# EAGLE design RoverWing-V1.4 (EAGLE 9.2.2)
Assembly variants: LCSC, DIGIKEY

## Sheet 1 of 2
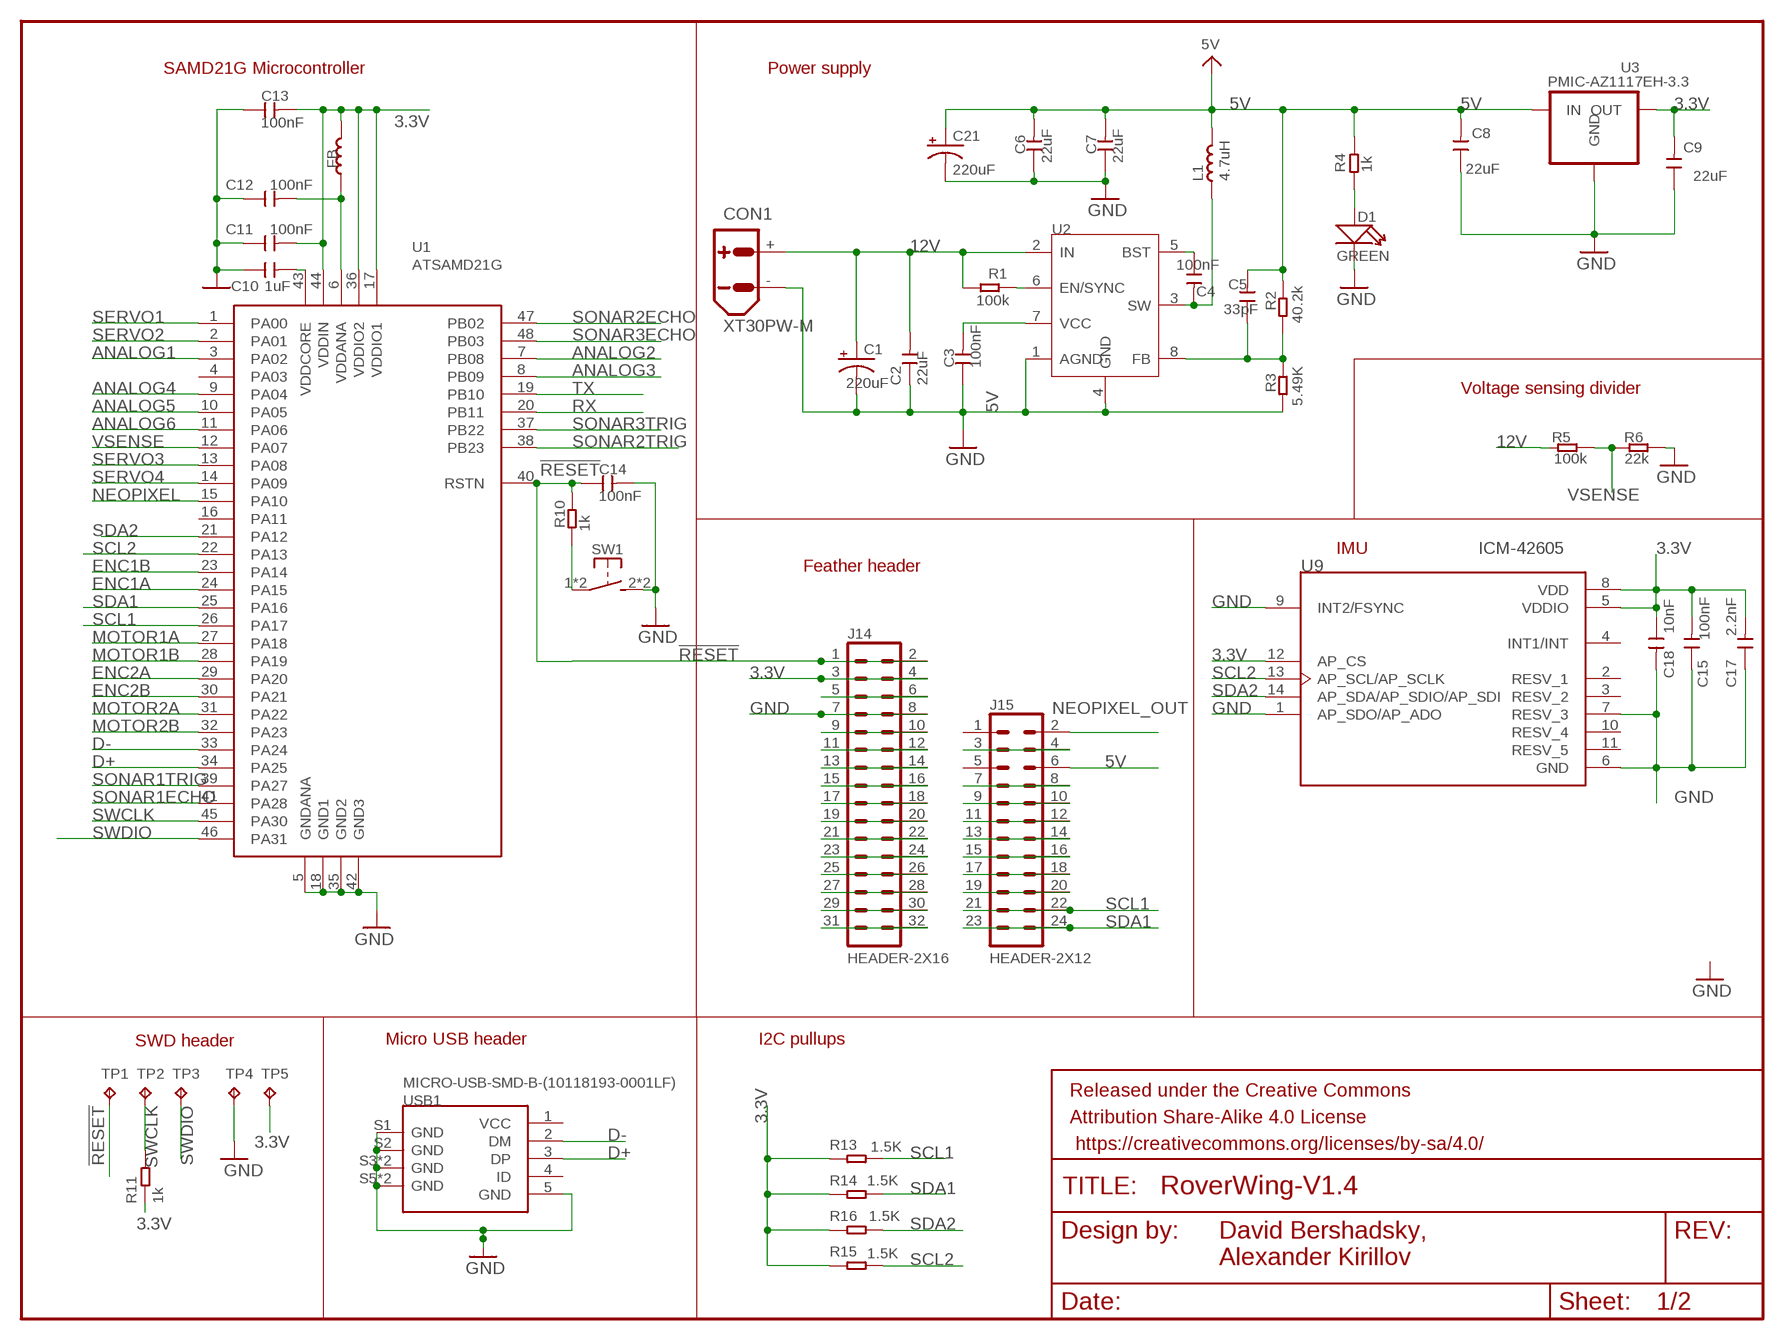
[diagram p0: schematic, sheet 1]

### Parts
C1  220uF  CAP-POL-SMD-8X10.5  [CAP-8X10.5]
C2  22uF  CAP-CERAMIC-SMD0805  [0805]
C3  100nF  CAP-CERAMIC-SMD0805  [0805]
C4  100nF  CAP-CERAMIC-SMD0805  [0805]
C5  33pF  CAP-CERAMIC-SMD0805  [0805]
C6  22uF  CAP-CERAMIC-SMD0805  [0805]
C7  22uF  CAP-CERAMIC-SMD0805  [0805]
C8  22uF  CAP-CERAMIC-SMD0805  [0805]
C9  22uF  CAP-CERAMIC-SMD0805  [0805]
C10  1uF  CAP-CERAMIC-SMD0805  [0805]
C11  100nF  CAP-CERAMIC-SMD0805  [0805]
C12  100nF  CAP-CERAMIC-SMD0805  [0805]
C13  100nF  CAP-CERAMIC-SMD0805  [0805]
C14  100nF  CAP-CERAMIC-SMD0805  [0805]
C15  100nF  CAP-CERAMIC-SMD0805  [0805]
C17  2.2nF  CAP-CERAMIC-SMD0805  [0805]
C18  10nF  CAP-CERAMIC-SMD0805  [0805]
C21  220uF  CAP-POL-SMD-6.3X5.4  [CAP-6.3X5.4]
CON1  XT30PW-M  [XT30PW-M]
D1  GREEN  SMD-LED-0805  [LED-0805]
FB  330R-1500MA  SMD-FERRITE-BEAD-330R-1500MA(0805)  [0805]
FRAME2  FRAME-LETTERNO_PACKAGE  [DUMMY]
J14  HEADER-2X16  [2X16]
J15  HEADER-2X12  [2X12]
L1  4.7uH  IND-TDK-SPM6530T  [IND_TDK_7.1X6.5]
R1  100k  RES-SMD-0805  [0805]
R2  40.2k  RES-SMD-0805  [0805]
R3  5.49K  RES-SMD-0805  [0805]
R4  1k  RES-SMD-0805  [0805]
R5  100k  RES-SMD-0805  [0805]
R6  22k  RES-SMD-0805  [0805]
R10  1k  RES-SMD-0805  [0805]
R11  1k  RES-SMD-0805  [0805]
R13  1.5K  SMD-RES-1.8K-1%-1/10W(0603)  [R0603]
R14  1.5K  SMD-RES-1.8K-1%-1/10W(0603)  [R0603]
R15  1.5K  SMD-RES-1.8K-1%-1/10W(0603)  [R0603]
R16  1.5K  SMD-RES-1.8K-1%-1/10W(0603)  [R0603]
SW1  SW-TACTILE-4.5X4.5_SMD  [TL3305]
TP1  TPTP15R  [TP15R]
TP2  TPTP15R  [TP15R]
TP3  TPTP15R  [TP15R]
TP4  TPTP15R  [TP15R]
TP5  TPTP15R  [TP15R]
U1  ATSAMD21G  [TQFP-48-EDITED]
U2  MP2225  PMIC-MP2225  [SOT-23-8]
U3  PMIC-AZ1117EH-3.3  [SOT223]
U9  ICM-42605  [PQFN50P300X250X97-14N]
USB1  MICRO-USB-SMD-B-(10118193-0001LF)  [MICRO-USB5+6P-SMD-0.65-B]

### Nets
3.3V: C9.2 C11.2 C13.2 C15.2 C17.2 C18.1 FB.2 J14.3 J14.4 R11.1 R13.1 R14.1 R15.1 R16.1 TP5.TP U1.17(VDDIO1) U1.36(VDDIO2) U1.44(VDDIN) U3.2(OUT) U3.4(OUT) U9.5(VDDIO) U9.8(VDD) U9.12(AP_CS) ; also sheet 2
5V: C5.2 C6.2 C7.2 C8.2 C21.+ J15.6 L1.2 R2.1 R4.2 U3.3(IN) ; also sheet 2
12V: C1.+ C2.2 CON1.+ R1.2 R5.2 U2.2(IN) ; also sheet 2
!RESET: C14.1 J14.1 J14.2 R10.2 TP1.TP U1.40(RSTN)
ANALOG1: U1.3(PA02) ; also sheet 2
ANALOG2: U1.7(PB08) ; also sheet 2
ANALOG3: U1.8(PB09) ; also sheet 2
ANALOG4: U1.9(PA04) ; also sheet 2
ANALOG5: U1.10(PA05) ; also sheet 2
ANALOG6: U1.11(PA06) ; also sheet 2
BST: C4.1 U2.5(BST)
D+: U1.34(PA25) USB1.3(DP)
D-: U1.33(PA24) USB1.2(DM)
ENC1A: U1.24(PA15) ; also sheet 2
ENC1B: U1.23(PA14) ; also sheet 2
ENC2A: U1.29(PA20) ; also sheet 2
ENC2B: U1.30(PA21) ; also sheet 2
FB: C5.1 R2.2 R3.1 U2.8(FB)
GND: C1.- C2.1 C3.1 C6.1 C7.1 C8.1 C9.1 C10.1 C11.1 C12.1 C13.1 C14.2 C15.1 C17.1 C18.2 C21.- CON1.- D1.- J14.7 J14.8 R3.2 R6.2 SW1.2(S1) SW1.3(S1) TP4.TP U1.5(GNDANA) U1.18(GND1) U1.35(GND2) U1.42(GND3) U2.1(AGND) U2.4(GND) U3.1(GND) U9.1(AP_SDO/AP_ADO) U9.6(GND) U9.7(RESV_3) U9.9(INT2/FSYNC) USB1.5(GND) USB1.S1(GND) USB1.S2(GND) USB1.S3(GND) USB1.S4(GND) USB1.S5(GND) USB1.S6(GND) ; also sheet 2
MOTOR1A: U1.27(PA18) ; also sheet 2
MOTOR1B: U1.28(PA19) ; also sheet 2
MOTOR2A: U1.31(PA22) ; also sheet 2
MOTOR2B: U1.32(PA23) ; also sheet 2
N$5: J15.3 J15.4
N$9: J15.7 J15.8
N$11: R10.1 SW1.1 SW1.4(P1)
N$12: J15.9 J15.10
N$14: C10.2 U1.43(VDDCORE)
N$15: J15.11 J15.12
N$17: D1.+ R4.1
N$18: J15.15 J15.16
N$22: J15.13 J15.14
N$23: R1.1 U2.6(EN/SYNC)
N$29: C3.2 U2.7(VCC)
N$42: J14.5 J14.6
N$45: J15.17 J15.18
N$46: J15.19 J15.20
N$48: J14.9 J14.10
N$49: J14.11 J14.12
N$50: J14.13 J14.14
N$51: J14.15 J14.16
N$52: J14.17 J14.18
N$53: J14.19 J14.20
N$54: J14.21 J14.22
N$55: J14.23 J14.24
N$56: J14.25 J14.26
N$57: J14.27 J14.28
N$58: J14.29 J14.30
N$59: J14.31 J14.32
NEOPIXEL: U1.15(PA10) ; also sheet 2
NEOPIXEL_OUT: J15.2 ; also sheet 2
RX: U1.20(PB11) ; also sheet 2
SCL1: J15.21 J15.22 R13.2 U1.26(PA17) ; also sheet 2
SCL2: R15.2 U1.22(PA13) U9.13(AP_SCL/AP_SCLK) ; also sheet 2
SDA1: J15.23 J15.24 R14.2 U1.25(PA16) ; also sheet 2
SDA2: R16.2 U1.21(PA12) U9.14(AP_SDA/AP_SDIO/AP_SDI) ; also sheet 2
SERVO1: U1.1(PA00) ; also sheet 2
SERVO2: U1.2(PA01) ; also sheet 2
SERVO3: U1.13(PA08) ; also sheet 2
SERVO4: U1.14(PA09) ; also sheet 2
SONAR1ECHO: U1.41(PA28) ; also sheet 2
SONAR1TRIG: U1.39(PA27) ; also sheet 2
SONAR2ECHO: U1.47(PB02) ; also sheet 2
SONAR2TRIG: U1.38(PB23) ; also sheet 2
SONAR3ECHO: U1.48(PB03) ; also sheet 2
SONAR3TRIG: U1.37(PB22) ; also sheet 2
SW: C4.2 L1.1 U2.3(SW)
SWCLK: R11.2 TP2.TP U1.45(PA30)
SWDIO: TP3.TP U1.46(PA31)
TX: U1.19(PB10) ; also sheet 2
VDDANA: C12.2 FB.1 U1.6(VDDANA)
VSENSE: R5.1 R6.1 U1.12(PA07)
Unconnected: J15.1 J15.5 U1.4(PA03) U1.16(PA11) U9.2(RESV_1) U9.3(RESV_2) U9.4(INT1/INT) U9.10(RESV_4) U9.11(RESV_5) USB1.1(VCC) USB1.4(ID)

### Notes on the sheet
- SAMD21G Microcontroller | Power supply
- Voltage sensing divider
- IMU
- Feather header
- SWD header
- Micro USB header | I2C pullups
- David Bershadsky, 
  Alexander Kirillov

## Sheet 2 of 2
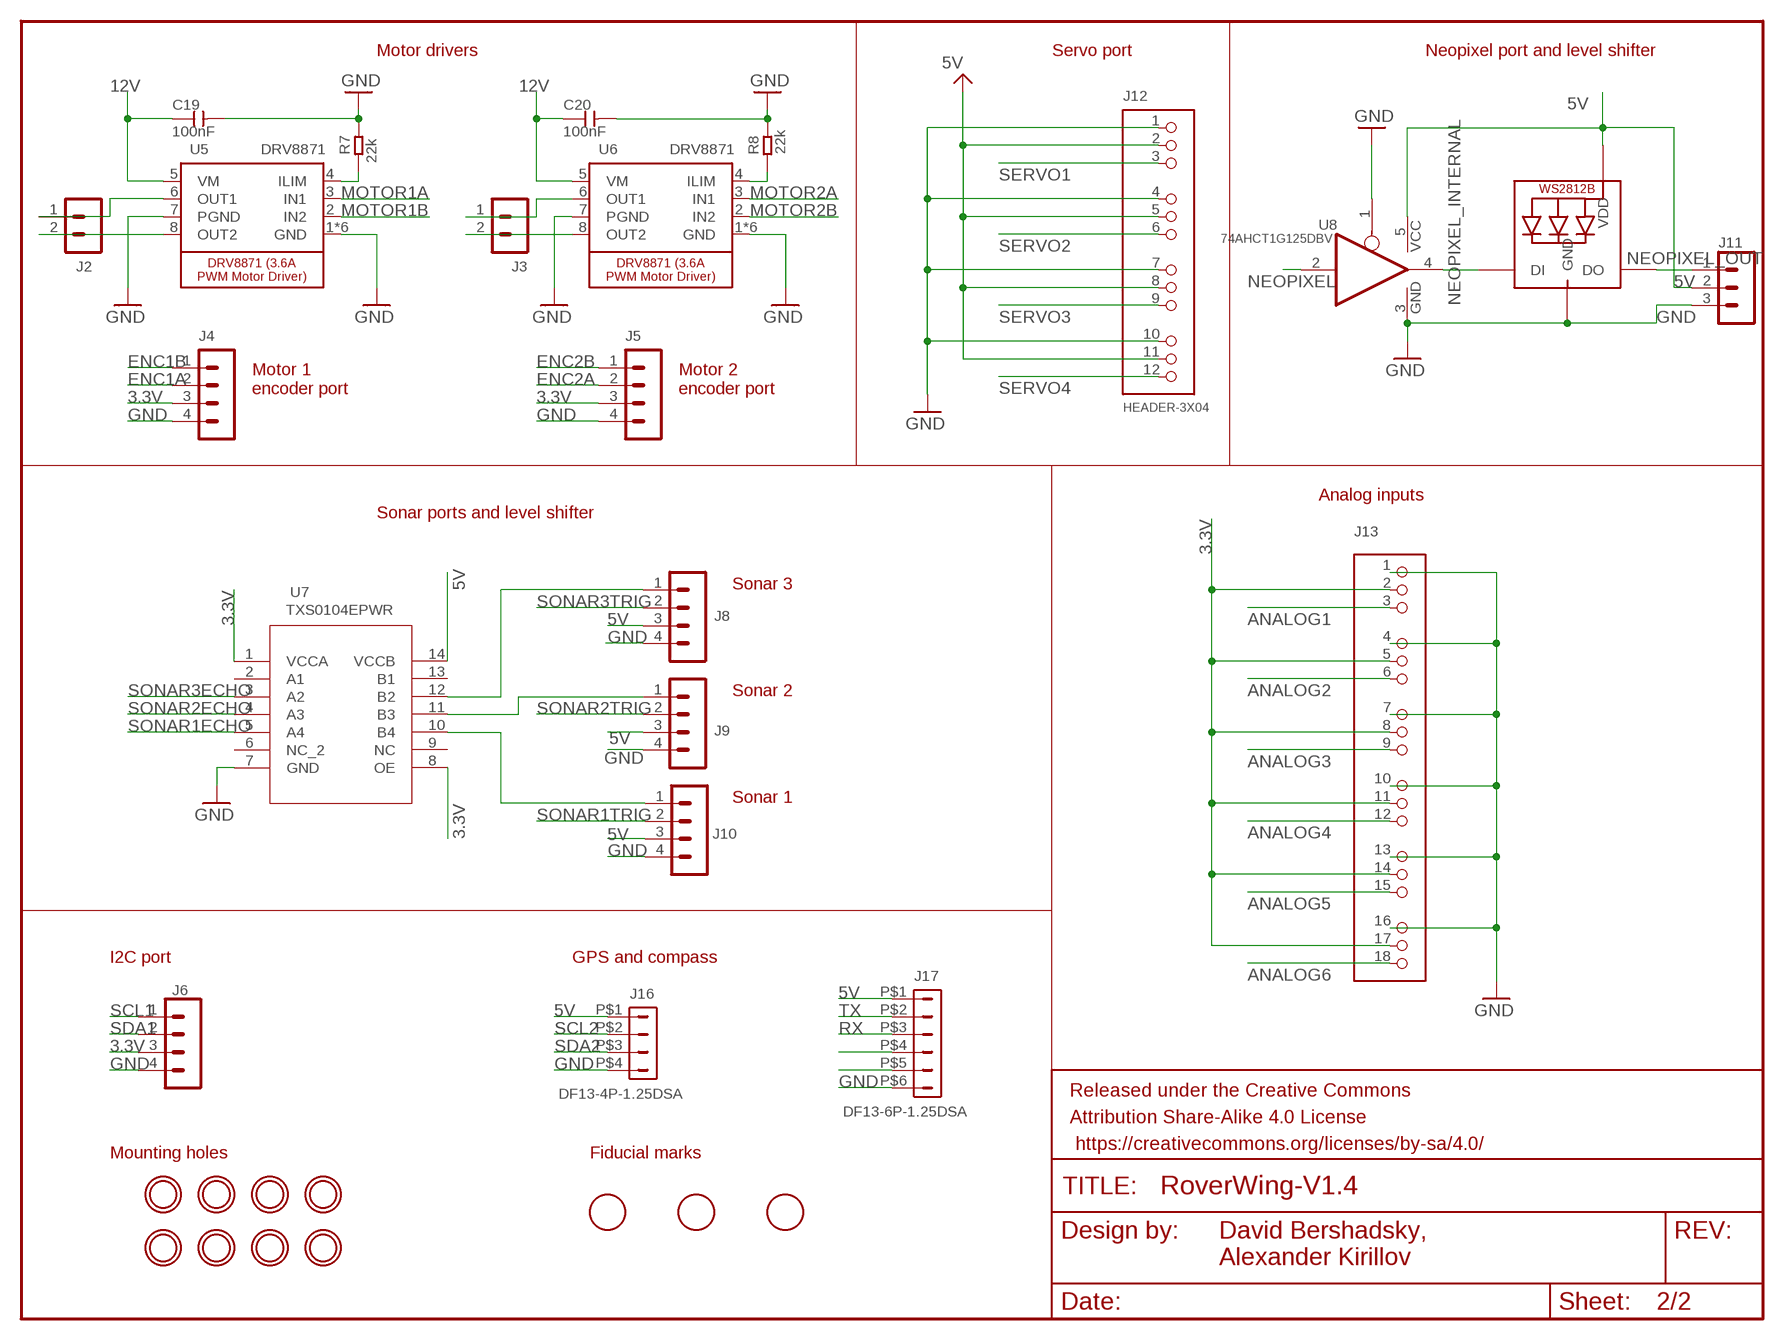
[diagram p1: schematic, sheet 2]

### Parts
C19  100nF  CAP-CERAMIC-SMD0805  [0805]
C20  100nF  CAP-CERAMIC-SMD0805  [0805]
D2  WS2812B3535  [LED3535]
FRAME1  FRAME-LETTERNO_PACKAGE  [DUMMY]
J2  HEADER-VH  [B2P-VH]
J3  HEADER-VH  [B2P-VH]
J4  HEADER-PH-4P  [B4B-PH-K]
J5  HEADER-PH-4P  [B4B-PH-K]
J6  HEADER-PH-4P  [B4B-PH-K]
J8  HEADER-PH-4P  [B4B-PH-K]
J9  HEADER-PH-4P  [B4B-PH-K]
J10  HEADER-PH-4P  [B4B-PH-K]
J11  HEADER-PH-3P  [B3B-PH-K]
J12  HEADER-3X04  [3X04]
J13  HEADER-3X06"  [3X06]
J16  DF13-4P-1.25DSA  [DF13-4P-1.25DSA]
J17  DF13-6P-1.25DSA  [DF13-6P-1.25DSA]
R7  22k  RES-SMD-0805  [0805]
R8  22k  RES-SMD-0805  [0805]
U5  DRV8871  [HSOP8]
U6  DRV8871  [HSOP8]
U7  TXS0104EPWR  [PW14]
U8  74AHCT1G125DBV  [SOT23-5]
U$3  MOUNTINGHOLE3.0_NPH  [MOUNTINGHOLE_3.0_NPH]
U$4  MOUNTINGHOLE3.0_NPH  [MOUNTINGHOLE_3.0_NPH]
U$11  FIDUCIAL  [FIDUCIAL_1MM]
U$13  FIDUCIAL  [FIDUCIAL_1MM]
U$14  MOUNTINGHOLE3.0_NPH  [MOUNTINGHOLE_3.0_NPH]
U$15  MOUNTINGHOLE3.0_NPH  [MOUNTINGHOLE_3.0_NPH]
U$17  FIDUCIAL  [FIDUCIAL_1MM]
U$24  MOUNTINGHOLE3.0_NPH  [MOUNTINGHOLE_3.0_NPH]
U$25  MOUNTINGHOLE3.0_NPH  [MOUNTINGHOLE_3.0_NPH]
U$26  MOUNTINGHOLE3.0_NPH  [MOUNTINGHOLE_3.0_NPH]
U$27  MOUNTINGHOLE3.0_NPH  [MOUNTINGHOLE_3.0_NPH]

### Nets
3.3V: J4.3 J5.3 J6.3 J13.2 J13.5 J13.8 J13.11 J13.14 J13.17 U7.1(VCCA) U7.8(OE) ; also sheet 1
5V: D2.3(VDD) J8.3 J9.3 J10.3 J11.2 J12.2 J12.5 J12.8 J12.11 J16.P$1 J17.P$1 U7.14(VCCB) U8.5(VCC) ; also sheet 1
12V: C19.1 C20.1 U5.5(VM) U6.5(VM) ; also sheet 1
ANALOG1: J13.3 ; also sheet 1
ANALOG2: J13.6 ; also sheet 1
ANALOG3: J13.9 ; also sheet 1
ANALOG4: J13.12 ; also sheet 1
ANALOG5: J13.15 ; also sheet 1
ANALOG6: J13.18 ; also sheet 1
ENC1A: J4.2 ; also sheet 1
ENC1B: J4.1 ; also sheet 1
ENC2A: J5.2 ; also sheet 1
ENC2B: J5.1 ; also sheet 1
GND: C19.2 C20.2 D2.1(GND) J4.4 J5.4 J6.4 J8.4 J9.4 J10.4 J11.3 J12.1 J12.4 J12.7 J12.10 J13.1 J13.4 J13.7 J13.10 J13.13 J13.16 J16.P$4 J17.P$6 R7.2 R8.2 U5.1(GND) U5.7(PGND) U5.GND U5.P$1(GND) U5.P$2(GND) U5.P$3(GND) U5.P$4(GND) U6.1(GND) U6.7(PGND) U6.GND U6.P$1(GND) U6.P$2(GND) U6.P$3(GND) U6.P$4(GND) U7.7(GND) U8.1(OE) U8.3(GND) ; also sheet 1
MOTOR1A: U5.3(IN1) ; also sheet 1
MOTOR1B: U5.2(IN2) ; also sheet 1
MOTOR2A: U6.3(IN1) ; also sheet 1
MOTOR2B: U6.2(IN2) ; also sheet 1
N$1: J3.2 U6.8(OUT2)
N$2: J3.1 U6.6(OUT1)
N$4: J2.2 U5.8(OUT2)
N$7: J10.1 U7.10(B4)
N$10: J8.1 U7.12(B2)
N$16: J2.1 U5.6(OUT1)
N$19: R7.1 U5.4(ILIM)
N$20: R8.1 U6.4(ILIM)
N$21: J9.1 U7.11(B3)
N$26: J17.P$4
N$27: J17.P$5
NEOPIXEL: U8.2(I) ; also sheet 1
NEOPIXEL_INTERNAL: D2.2(DI) U8.4(O)
NEOPIXEL_OUT: D2.4(DO) J11.1 ; also sheet 1
RX: J17.P$3 ; also sheet 1
SCL1: J6.1 ; also sheet 1
SCL2: J16.P$2 ; also sheet 1
SDA1: J6.2 ; also sheet 1
SDA2: J16.P$3 ; also sheet 1
SERVO1: J12.3 ; also sheet 1
SERVO2: J12.6 ; also sheet 1
SERVO3: J12.9 ; also sheet 1
SERVO4: J12.12 ; also sheet 1
SONAR1ECHO: U7.5(A4) ; also sheet 1
SONAR1TRIG: J10.2 ; also sheet 1
SONAR2ECHO: U7.4(A3) ; also sheet 1
SONAR2TRIG: J9.2 ; also sheet 1
SONAR3ECHO: U7.3(A2) ; also sheet 1
SONAR3TRIG: J8.2 ; also sheet 1
TX: J17.P$2 ; also sheet 1
Unconnected: U7.2(A1) U7.6(NC_2) U7.9(NC) U7.13(B1)

### Notes on the sheet
- Motor drivers | Servo port | Neopixel port and level shifter
- Motor 1
  encoder port
- Motor 2 
  encoder port
- Analog inputs
- Sonar ports and level shifter
- Sonar 3
- Sonar 2
- Sonar 1
- I2C port | GPS and compass
- Mounting holes | Fiducial marks
- David Bershadsky, 
  Alexander Kirillov

## Library data of the parts
C1 = RoverWing:CAP-POL-SMD-8X10.5: AL CAPACITOR, SMD 8x10.5 mm
C2-C15 C17-C20 = RoverWing:CAP-CERAMIC-SMD: CAP CERAMIC, SMD
C21 = RoverWing:CAP-POL-SMD-6.3X5.4: AL CAP, SMD, 47uF; PARTNO: CS1E470M-CRE54
CON1 = amass:XT30: AMASS XT30 connector Store in Japan AMASS XT30 connector <https://szc.jp/ams-xt30>
D1 = RoverWing:SMD-LED-0805: SMD LED, 0805
D2 = RoverWing:WS2812B; MANUFACTURER: Worldsemi; PARTNO: WS2812B-3535
FB = RoverWing:SMD-FERRITE-BEAD-330R-1500MA(0805): Ferrite Bead 330R, 1500 MA; PARTNO: BLM21PG331SN1D; SIZE: 0805
FRAME1 FRAME2 = RoverWing:FRAME-LETTER: Schematic Frame - Letter Standard 8.5x11 US Letter frame; BOM: EXCLUDE
J2 J3 = RoverWing:HEADER-VH: HEADER - JST VH, 2P 3.96mm pitch; PARTNO: B2P-VH(LF)(SN)
J4-J6 J8-J10 = RoverWing:HEADER-PH-4P: HEADER; PARTNO: B4B-PH-K-S(LF)(SN)
J11 = RoverWing:HEADER-PH-3P: HEADER; PARTNO: B3B-PH-K-S(LF)(SN)
J12 = RoverWing:HEADER-3X04
J13 = RoverWing:HEADER-3X06
J14 = RoverWing:HEADER-2X16: HEADER - 2x16, 0.1" PITCH
J15 = RoverWing:HEADER-2X12: Multi connection point. Often used as Generic Header-pin footprint for 0.1 inch spaced/style header connections On any of the 0.1 inch spaced packages, you can populate with these: Break Away Headers - Straight <https://www.sparkfun.com/products/116> (PRT-00116) Break Away Male Headers - Right Angle <https://www.sparkfun.com/products/553> (PRT-00553) Female Headers <https://www.sparkfun.com/products/115> (PRT-00115) Break Away Headers - Machine Pin <https://www.sparkfun.com/products/117> (PRT-00117) Break Away Female Headers - Swiss Machine Pin <https://www.sparkfun.com/products/743> (PRT-00743)
J16 = RoverWing:DF13-4P-1.25: DF13-4P 1.25mm Pitch Miniature Crimping Connector.; PARTNO: DF13-4P-1.25DSA
J17 = RoverWing:DF13-6P-1.25: DF13-6P 1.25mm Pitch Miniature Crimping Connector.; PARTNO: DF13-6P-1.25DSA
L1 = RoverWing:IND-TDK-SPM6530T: Power inductor, SMD, 4.7uH, 5.2A Manufacturer: TDK; MANUFACTURER: TDK; PARTNO: SPM6530T-4R7M
R1-R8 R10 R11 = RoverWing:RES-SMD-0805
R13-R16 = Seeed-Resistor:SMD-RES-1.8K-1%-1/10W(0603): 301010254; MPN: RC0603FR-071K8L; VALUE: 1.8K
SW1 = RoverWing:SW-TACTILE: Tactile Switche; MANUFACTURER: BRIGHT; PARTNO: TSA453G38-250
TP1-TP5 = RoverWing:TP: Test pad; BOM: EXCLUDE
U1 = RoverWing:ATSAMD21G: SAMD21G MCU ARM® Cortex®-M0+ SAM D21G Microcontroller by Microchip Technology Specs: 32 bits 48 Mhz frequency 256 KB flash memory, 32 KB RAM Package: TQFP48 MPN: ATSAMD21G18A-AU; MANUFACTURER: Microchip Technology; PARTNO: ATSAMD21G18A-AU
U2 = RoverWing:PMIC-MP2225: MP2225 buck converter Manufacturer: Monolithic Power Systems Specs: Vin: 4.5-18 V Vout: up to 13.7 V Iout: up to 5A; MANUFACTURER: Monolithic Power Systems; PARTNO: MP2225GJ
U3 = RoverWing:PMIC-AZ1117EH-*; PARTNO: AZ1117EH-3.3TRG1
U5 U6 = RoverWing:DRV8871: DRV8871 - 3.6A PWM Motor Driver; MANUFACTURER: TEXAS INSTRUMENTS; PARTNO: DRV8871DDAR; SIZE: HSOP8
U7 = RoverWing:TXS0104EPWR: Bidirectional Voltage Level Translator, 4 Channel; MANUFACTURER: Texas Instruments; PARTNO: TXS0104EPWR
U8 = RoverWing:74*1G125: Single Bus Buffer Gate with 3-State Output; PARTNO: SN74AHCT1G125DBVR
U9 = ICM-42605:ICM-42605: Single-Interface MotionTracking device The ICM-42605 is a 6-axis MotionTracking device that combines a 3-axis gyroscope, and a 3-axis accelerometer in a small 2.5x3x0.91 mm (14-pin LGA) package. It also features a 2K-byte FIFO that can lower the traffic on the serial bus interface, and reduce power consumption by allowing the system processor to burst read sensor data and then go into a low-power mode.; DESCRIPTION: Accelerometer, Gyroscope, 6 Axis Sensor I²C, I3C℠, SPI Output; DIGI-KEY_PART_NUMBER: 1428-1152-1-ND; DIGI-KEY_PURCHASE_URL: https://www.digikey.com/product-detail/en/tdk-invensense/ICM-42605/1428-1152-1-ND/9953675?utm_source=snapeda&utm_medium=aggregator&utm_campaign=symbol; MF: TDK InvenSense; MP: ICM-42605; PACKAGE: - TDK InvenSense
U$3 U$4 U$14 U$15 U$24-U$27 = RoverWing:MOUNTINGHOLE: Mounting Hole For #2 screws (0.086"/2.18mm width, 0.094"/2.4mm hole) use 2.5mm; BOM: EXCLUDE
U$11 U$13 U$17 = RoverWing:FIDUCIAL: For use by pick and place machines to calibrate the vision/machine, 1mm By microbuilder.eu; BOM: EXCLUDE
USB1 = RoverWing:MICRO-USB-SMD-B-(10118193-0001LF): 320010003; MANUFACTURER: Amphenol ICC; PARTNO: 10118193-0001LF

## Net classes
1 thinpower: width 0.305 mm
2 thickpower: width 0.406 mm

## Board
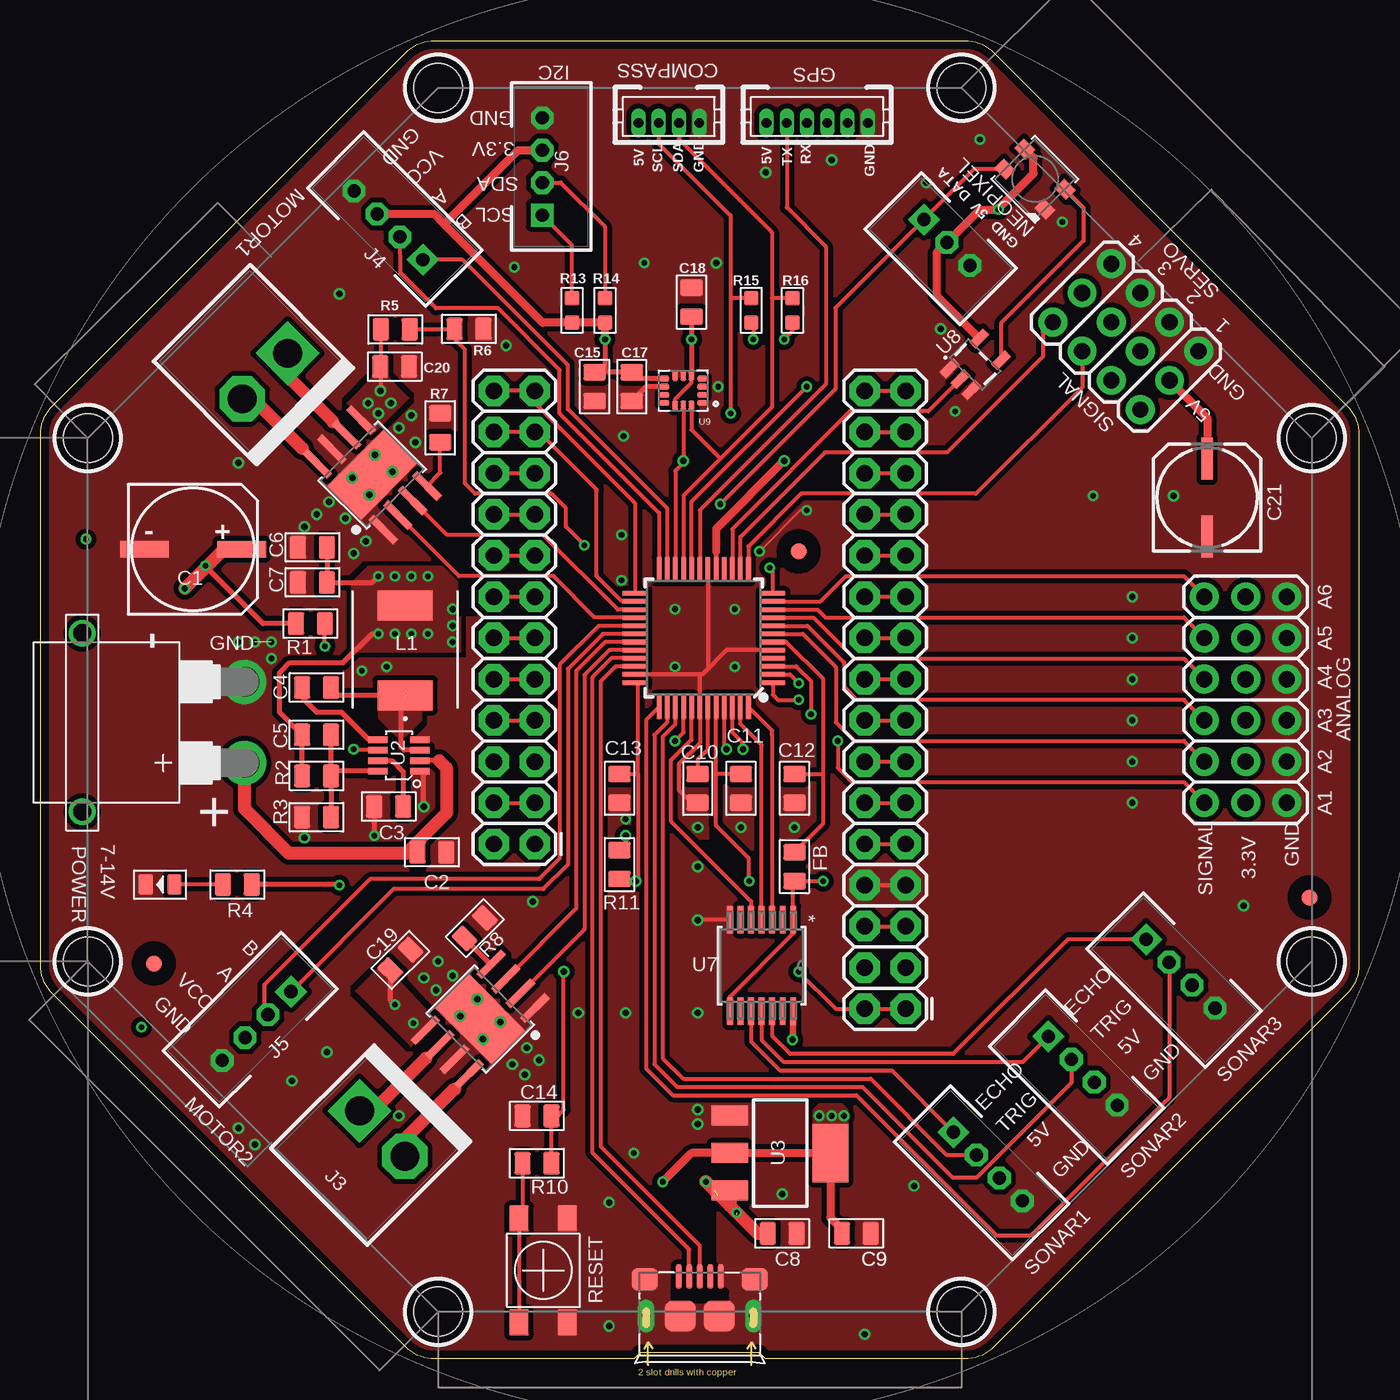
[diagram p2: board, top side]
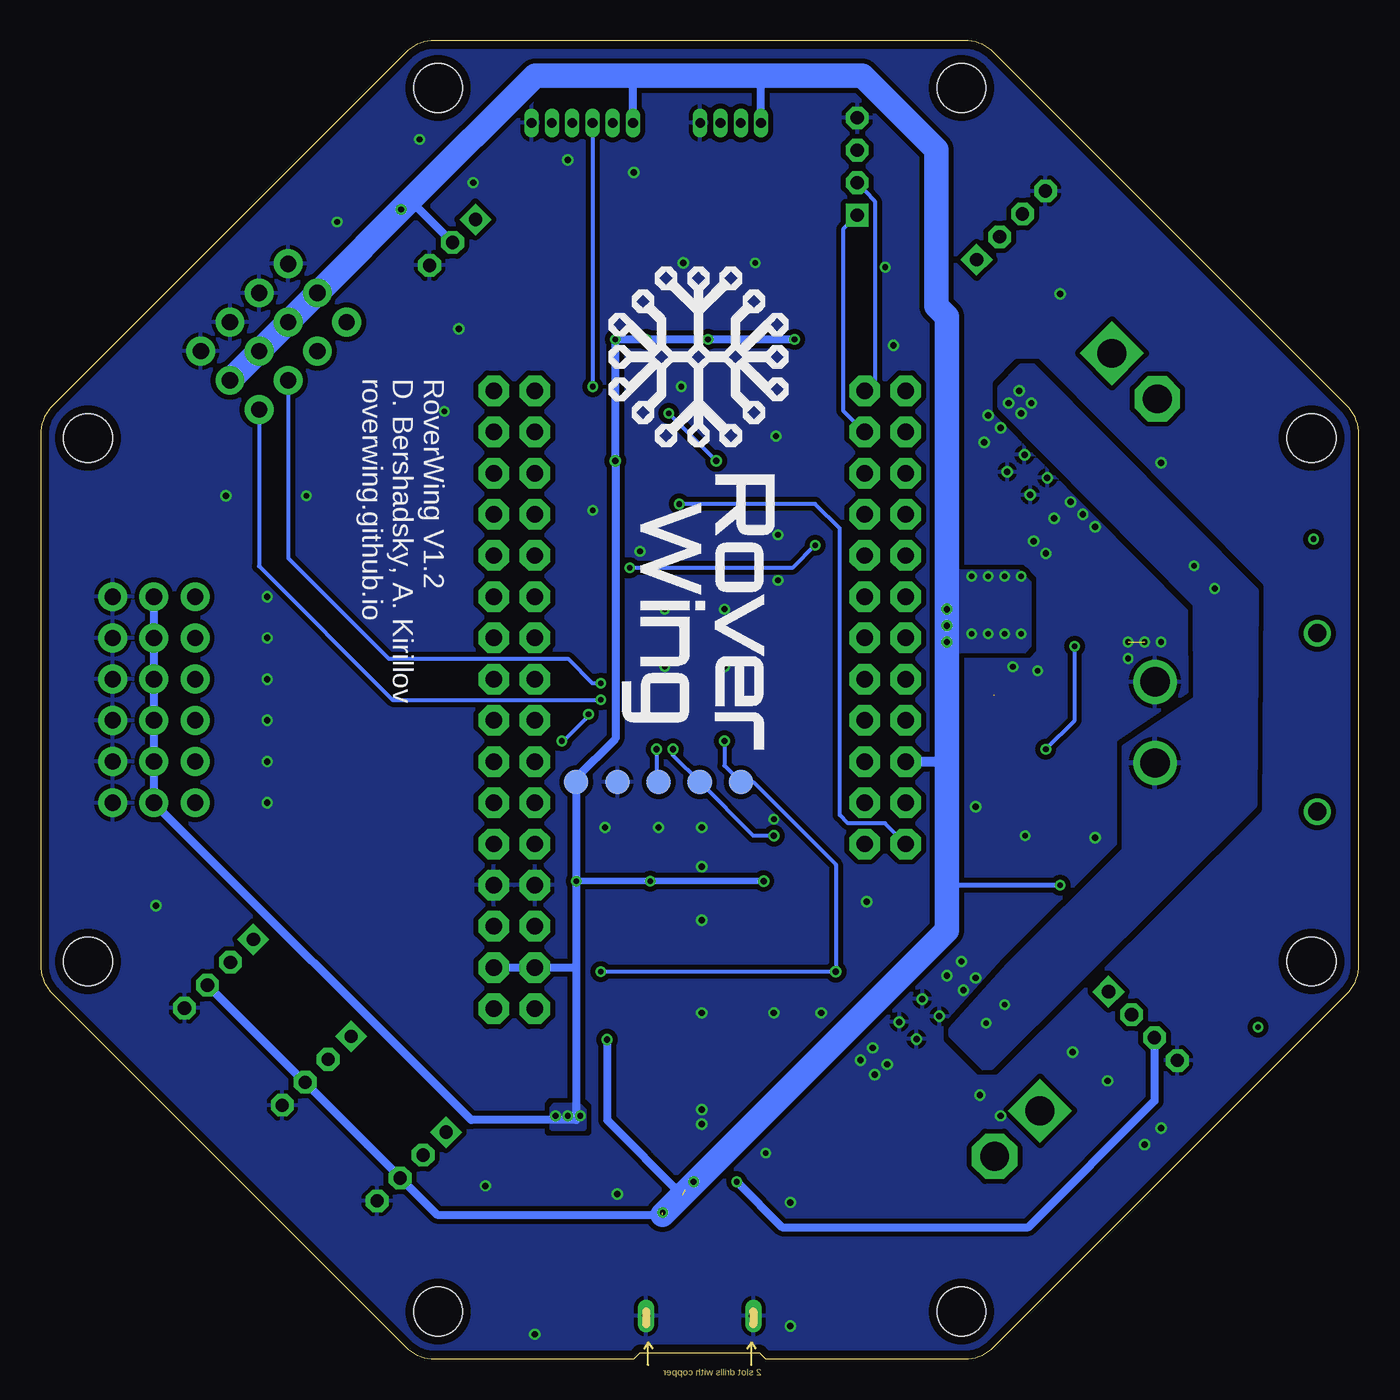
[diagram p3: board, bottom side, seen from below]

Size 81.28 x 81.28 mm. Coordinates in mm from the lower left corner, seen from the top.
Outline: 0,24.29 0,56.99 arc-45 0.74,58.78 22.5,80.54 arc-45 24.29,81.28 56.99,81.28 arc-45 58.78,80.54 80.54,58.78 arc-45 81.28,56.99 81.28,24.29 arc-45 80.54,22.5 58.78,0.74 arc-45 56.99,0 44.7,0 44.32,0.38 36.96,0.38 36.58,0 24.29,0 arc-45 22.5,0.74 0.74,22.5 arc-45 0,24.29
Copper layers (1*16): Top 0.035mm / dielectric 1.6mm / Bottom 0.035mm
Design rules "Elecrow_2-layer_PCB_eagle_rule": minimum track width 6mil, minimum drill 12mil, track to track 6mil, track to pad 6mil, pad to pad 6mil, via to via 8mil, smd to smd 0mil, copper to edge 20mil, drill to drill 10mil, minimum pad ring 6mil, minimum via ring 6mil, stop-mask expansion 0mil, vias tented up to drill 100mil, thermal gap 10mil

### Footprints (pad centres in the part's own frame; a part is rotated, then mirrored left to right if it is on the bottom)
CAP-8X10.5 = smd 3 x 1: + 3,0; - -3,0
0805 = smd 1.016 x 1.397: 1 -0.889,0; 2 0.889,0
CAP-6.3X5.4 = smd 2.6 x 0.7: + 2.4,0; - -2.4,0
XT30PW-M = drill 1.8: + -2.5,0; - 2.5,0 | drill 1.1: P$3 -5.5,10; P$4 5.5,10
LED-0805 = smd 0.889 x 1.27: + -0.889,0; - 0.889,0
LED3535 = smd 1 x 0.85: 1 -1.75,0.875; 2 -1.75,-0.875; 3 1.75,-0.875; 4 1.75,0.875
B2P-VH = drill 1.778 pad 2.794 square: 1 -1.98,0 | drill 1.778 pad 2.794 octagon: 2 1.98,0
B4B-PH-K = drill 0.813 pad 1.397 square: 1 3,0 | drill 0.813 pad 1.397 octagon: 2 1,0; 3 -1,0; 4 -3,0
B3B-PH-K = drill 0.813 pad 1.397 square: 1 2,0 | drill 0.813 pad 1.397 octagon: 2 0,0; 3 -2,0
3X04 = drill 1 pad 1.778: 1 -3.81,-2.54; 2 -3.81,0; 3 -3.81,2.54; 4 -1.27,-2.54; 5 -1.27,0; 6 -1.27,2.54; 7 1.27,-2.54; 8 1.27,0; 9 1.27,2.54; 10 3.81,-2.54; 11 3.81,0; 12 3.81,2.54
3X06 = drill 1 pad 1.778: 1 -6.35,-2.54; 2 -6.35,0; 3 -6.35,2.54; 4 -3.81,-2.54; 5 -3.81,0; 6 -3.81,2.54; 7 -1.27,-2.54; 8 -1.27,0; 9 -1.27,2.54; 10 1.27,-2.54; 11 1.27,0; 12 1.27,2.54; 13 3.81,-2.54; 14 3.81,0; 15 3.81,2.54; 16 6.35,-2.54; 17 6.35,0; 18 6.35,2.54
2X16 = drill 1.016 pad 1.88 octagon: 1 0,0; 2 0,2.54; 3 2.54,0; 4 2.54,2.54; 5 5.08,0; 6 5.08,2.54; 7 7.62,0; 8 7.62,2.54; 9 10.16,0; 10 10.16,2.54; 11 12.7,0; 12 12.7,2.54; 13 15.24,0; 14 15.24,2.54; 15 17.78,0; 16 17.78,2.54; 17 20.32,0; 18 20.32,2.54; 19 22.86,0; 20 22.86,2.54; 21 25.4,0; 22 25.4,2.54; 23 27.94,0; 24 27.94,2.54; 25 30.48,0; 26 30.48,2.54; 27 33.02,0; 28 33.02,2.54; 29 35.56,0; 30 35.56,2.54; 31 38.1,0; 32 38.1,2.54
2X12 = drill 1.016 pad 1.88 octagon: 1 0,0; 2 0,2.54; 3 2.54,0; 4 2.54,2.54; 5 5.08,0; 6 5.08,2.54; 7 7.62,0; 8 7.62,2.54; 9 10.16,0; 10 10.16,2.54; 11 12.7,0; 12 12.7,2.54; 13 15.24,0; 14 15.24,2.54; 15 17.78,0; 16 17.78,2.54; 17 20.32,0; 18 20.32,2.54; 19 22.86,0; 20 22.86,2.54; 21 25.4,0; 22 25.4,2.54; 23 27.94,0; 24 27.94,2.54
DF13-4P-1.25DSA = drill 0.6 pad 0.8 long: P$1 1.875,0; P$2 0.625,0; P$3 -0.625,0; P$4 -1.875,0
DF13-6P-1.25DSA = drill 0.6 pad 0.9 long: P$1 3.125,0; P$2 1.875,0; P$3 0.625,0; P$4 -0.625,0; P$5 -1.875,0; P$6 -3.125,0
IND_TDK_7.1X6.5 = smd 1.85 x 3.4: 1 -2.775,0; 2 2.775,0
R0603 = smd 0.889 x 0.889: 1 0,0.762; 2 0,-0.762
TL3305 = smd 1.6 x 1.2: 1 -3.2,1.5; 2 -3.2,-1.5; 3 3.2,-1.5; 4 3.2,1.5
TP15R = smd 1.5 x 1.5: TP 0,0
TQFP-48-EDITED = smd 1.5 x 0.28: 1 -4.25,2.75; 2 -4.25,2.25; 3 -4.25,1.75; 4 -4.25,1.25; 5 -4.25,0.75; 6 -4.25,0.25; 7 -4.25,-0.25; 8 -4.25,-0.75; 9 -4.25,-1.25; 10 -4.25,-1.75; 11 -4.25,-2.25; 12 -4.25,-2.75; 25 4.25,-2.75; 26 4.25,-2.25; 27 4.25,-1.75; 28 4.25,-1.25; 29 4.25,-0.75; 30 4.25,-0.25; 31 4.25,0.25; 32 4.25,0.75; 33 4.25,1.25; 34 4.25,1.75; 35 4.25,2.25; 36 4.25,2.75 | smd 0.28 x 1.5: 13 -2.75,-4.25; 14 -2.25,-4.25; 15 -1.75,-4.25; 16 -1.25,-4.25; 17 -0.75,-4.25; 18 -0.25,-4.25; 19 0.25,-4.25; 20 0.75,-4.25; 21 1.25,-4.25; 22 1.75,-4.25; 23 2.25,-4.25; 24 2.75,-4.25; 37 2.75,4.25; 38 2.25,4.25; 39 1.75,4.25; 40 1.25,4.25; 41 0.75,4.25; 42 0.25,4.25; 43 -0.25,4.25; 44 -0.75,4.25; 45 -1.25,4.25; 46 -1.75,4.25; 47 -2.25,4.25; 48 -2.75,4.25
SOT-23-8 = smd 0.4 x 1.2: 1 -0.975,-1.3; 2 -0.325,-1.3; 3 0.325,-1.3; 4 0.975,-1.3; 5 0.975,1.3; 6 0.325,1.3; 7 -0.325,1.3; 8 -0.975,1.3
SOT223 = smd 1.219 x 2.235: 1 -2.311,-3.099; 2 0,-3.099; 3 2.311,-3.099 | smd 3.6 x 2.2: 4 0,3.099
HSOP8 = smd 0.45 x 2.15: 1 -1.905,-2.875; 2 -0.635,-2.875; 3 0.635,-2.875; 4 1.905,-2.875; 5 1.905,2.875; 6 0.635,2.875; 7 -0.635,2.875; 8 -1.905,2.875 | smd 4.9 x 2.95: GND 0,0 | drill 0.4: P$1 -1,0.75; P$2 -1,-0.75; P$3 1,-0.75; P$4 1,0.75
PW14 = smd 1.676 x 0.356: 1 -2.819,1.95; 2 -2.819,1.3; 3 -2.819,0.65; 4 -2.819,0; 5 -2.819,-0.65; 6 -2.819,-1.3; 7 -2.819,-1.95; 8 2.819,-1.95; 9 2.819,-1.3; 10 2.819,-0.65; 11 2.819,0; 12 2.819,0.65; 13 2.819,1.3; 14 2.819,1.95
SOT23-5 = smd 0.55 x 1.2: 1 -0.95,-1.3; 2 0,-1.3; 3 0.95,-1.3; 4 0.95,1.3; 5 -0.95,1.3
PQFN50P300X250X97-14N = smd 0.61 x 0.35: 1 -1.16,0.75; 2 -1.16,0.25; 3 -1.16,-0.25; 4 -1.16,-0.75; 8 1.16,-0.75; 9 1.16,-0.25; 10 1.16,0.25; 11 1.16,0.75 | smd 0.35 x 0.61: 5 -0.5,-0.91; 6 0,-0.91; 7 0.5,-0.91; 12 0.5,0.91; 13 0,0.91; 14 -0.5,0.91
MOUNTINGHOLE_3.0_NPH = hole 3: 0,0
FIDUCIAL_1MM = smd 1 x 1: 1 0,0
MICRO-USB5+6P-SMD-0.65-B = smd 0.4 x 1.5: 1 -1.3,-0.25; 2 -0.65,-0.25; 3 0,-0.25; 4 0.65,-0.25; 5 1.3,-0.25 | smd 1.6 x 1.4: S1 -3.4,-0.427; S6 3.4,-0.427 | drill 0.508 pad 1.016 long: S2 -3.3,-2.675; S5 3.3,-2.675 | smd 1.9 x 1.9: S3 -1.2,-2.675; S4 1.2,-2.675

### Placement (x,y rotation side)
C1  9.4,49.91 0 top
C2  24.13,31.24 180 top
C3  21.46,34.06 0 top
C4  17.02,41.4 0 top
C5  17.02,38.48 180 top
C6  16.76,50.04 0 top
C7  16.76,47.88 0 top
C8  45.72,7.75 180 top
C9  50.29,7.75 180 top
C10  40.51,35.18 90 top
C11  43.18,35.18 90 top
C12  46.48,35.18 90 top
C13  35.69,35.18 90 top
C14  30.61,14.99 180 top
C15  34.16,59.94 90 top
C17  36.45,59.94 90 top
C18  40.13,65.15 90 top
C19  22.19,24.6 45 top
C20  21.83,61.18 0 top
C21  71.92,53.1 90 top
CON1  12.57,39.24 90 top
D1  7.37,29.24 180 top
D2  61.3,72.73 135 top
FB  46.48,30.35 270 top
FRAME1  76.84,81.15 0 top
FRAME2  77.85,82.17 0 top
J2  13.83,60.59 225 top
J3  21.06,13.9 315 top
J4  21.45,69.89 315 top
J5  13.31,20.52 45 top
J6  30.93,73.52 270 top
J8  70.28,23.75 135 top
J9  64.26,17.76 135 top
J10  58.4,11.86 135 top
J11  55.88,68.83 135 top
J12  66.91,63.03 135 top
J13  74.3,40.64 90 top
J14  53.34,21.59 90 top
J15  30.48,31.75 90 top
J16  38.73,76.2 180 top
J17  47.88,76.2 180 top
L1  22.48,43.69 90 top
R1  16.64,45.34 180 top
R2  17.02,35.94 0 top
R3  17.02,33.4 180 top
R4  12.13,29.24 0 top
R5  21.87,63.48 180 top
R6  26.42,63.5 0 top
R7  24.64,57.4 90 top
R8  26.77,26.56 45 top
R10  30.61,12.07 0 top
R11  35.69,30.48 90 top
R13  32.77,64.64 180 top
R14  34.8,64.64 180 top
R15  43.81,64.64 180 top
R16  46.36,64.64 180 top
SW1  30.99,5.46 90 top
TP1  38.1,35.56 0 bottom
TP2  40.64,35.56 0 bottom
TP3  43.18,35.56 0 bottom
TP4  45.72,35.56 0 bottom
TP5  48.26,35.56 0 bottom
U1  40.89,44.45 180 top
U2  22.1,37.21 90 top
U3  45.59,12.7 270 top
U5  20.45,54.5 45 top
U6  27.1,20.96 135 top
U7  44.45,24.26 270 top
U8  57.63,61.32 315 top
U9  39.62,59.69 180 top
U$3  24.51,2.92 0 top
U$4  56.77,2.92 0 top
U$11  78.23,28.45 0 top
U$13  6.98,24.38 0 top
U$14  2.92,24.51 0 top
U$15  2.92,56.77 0 top
U$17  46.74,49.78 0 top
U$24  78.36,24.51 0 top
U$25  78.36,56.77 0 top
U$26  24.51,78.36 0 top
U$27  56.77,78.36 0 top
USB1  40.64,5.33 0 top

### Tracks (layer width: path | path; a pad name or v marks a point on that pad's centre or on a via)
3.3V  (via drill 0.35, 0.39)
  Top 0.254: v43.69,29.46 43.67,30.86 41.64,32.88 41.64,36.07 | U1.36 36.83,41.51 36.83,36.07 | v48.26,29.46 FB.2 46.4,29.38 U7.1 46.4,26.23 42.5,22.33 U7.8 | v34.8,62.87 34.8,63.23 | 41.64,36.07 U1.44 | C13.2 36.83,36.07 | C11.2 41.64,36.07 | 36.83,36.07 36.83,29.59 v36.7,29.46 35.81,29.46 R11.1 | 49.4,8 C9.2 | R15.1 43.94,63.75 v43.94,62.87 | R16.1 46.36,63.37 v45.85,62.87 | U9.12 39.12,59.19 40.12,60.19 U9.5
  Top 0.305: 41.64,49.78 U1.17 | U9.8 36.84,60.44 C17.2 34.67,60.83 | 34.67,60.83 C15.2 | v34.8,62.87 34.8,60.96 34.67,60.83 | C18.1 v40.13,62.87 40.13,60.61 U9.5
  Top 0.508: v45.85,55.37 41.64,51.17 41.64,49.78 | v38.35,10.92 40.13,12.7 U3.2 U3.4 48.69,8.71 49.4,8 | J4.3 24.25,70.59 24.88,69.96 | 24.88,69.96 29.43,74.52 J6.3 30.95,74.54 | v34.8,62.87 R14.1 R13.1 30.96,63.88 24.88,69.96
  Bottom 0.406: 48.26,35.81 TP5.TP | v48.26,29.46 v43.69,29.46 v36.7,29.46
  Bottom 0.508: 48.26,35.81 45.85,38.23 v45.85,55.37 v45.85,62.87 v43.94,62.87 v40.13,62.87 v34.8,62.87 | TP5.TP v48.26,29.46 48.26,24.13 | J13.17 J13.14 J13.11 J13.8 J13.5 J13.2 54.74,14.73 48.26,14.73 48.26,24.13 | J14.3 J14.4 48.26,24.13 | v38.35,10.92 35.56,8.13 20.38,8.13 12.61,15.9 J5.3
  other vias: 48.01,14.99 48.77,14.99 49.53,14.99
  pour Top (no thermals): 47.62,14.22 47.62,15.37 48.01,15.75 49.28,15.75 49.4,15.75 49.78,15.37 49.78,14.22
  pour Bottom (no thermals): 47.62,15.37 48.01,15.75 49.66,15.75 49.91,15.49 49.91,14.22 49.78,14.1 47.75,14.1 47.62,14.22
5V  (via drill 0.35, 0.39)  (2 unrouted)
  Top 0.254: v46.34,19.7 v46.36,19.69 46.4,19.73
  Top 0.305: C6.2 C7.2 20.45,47.88 v20.83,48.26 | R2.1 C5.2 14.73,39.88 14.73,42.29 15.37,42.93 18.67,42.93 20.45,44.7 v20.83,44.7 | v18.41,29.21 18.38,29.24 R4.2
  Top 0.406: U7.14 46.4,19.73 | U3.3 42.49,10.34
  Top 0.508: D2.3 61.21,74.06 61.21,73.09 59.05,70.93 v59.05,70.87 57.91,70.87 J11.2 55.25,68.2 55.25,65.54 U8.5 | J12.2 71.92,58.01 C21.+
  Top 0.813: 42.49,9.45 U3.3 41.55,10.39 v41.02,10.92 42.49,9.45 | 42.49,9.45 44.2,7.75 C8.2
  Bottom 0.305: 25.4,29.21 v18.41,29.21 18.29,29.21
  Bottom 0.406: 65.01,17.06 J9.3 | 59.11,11.21 J10.3
  Bottom 0.508: v46.36,19.69 46.36,14.73 41.72,10.1 | J8.3 65.01,17.06 | J9.3 59.11,11.21 | J10.3 56.85,8.89 42.93,8.89 | J16.P$1 36.86,78.84 36.58,79.12 | J17.P$1 44.75,79.07 44.7,79.12 | J11.2 58.48,71.44
  Bottom 0.61: J15.6 25.4,36.83
  Bottom 1.524: 42.93,8.89 41.72,10.1 25.4,26.42 25.4,29.21 25.4,36.83 v25.4,44.2 25.4,64.26 26.04,64.9 26.04,74.55 30.61,79.12 36.58,79.12 44.7,79.12 50.8,79.12 58.48,71.44 J12.11 J12.8 67.68,62.25 67.68,62.14 67.79,62.14 J12.5 J12.2
  other vias: 25.4,46.23 25.4,45.21 42.93,9.02 23.88,44.7 22.86,44.7 21.84,44.7 23.88,48.26 22.86,48.26 21.84,48.26
  pour Top (no thermals): 19.18,43.56 19.18,47.88 20.19,48.89 25.91,48.89 25.91,43.56
  pour Bottom (no thermals): 25.91,43.56 20.57,43.56 20.19,43.94 20.19,47.88 20.96,48.64 25.15,48.64 25.91,47.88
12V  (via drill 0.35, 0.39)
  Top 0.254: R5.2 20.98,59.71 v20.96,59.69
  Top 0.305: 24.58,36.89 U2.2 | R1.2 13.72,45.34 v10.16,48.9 | C2.2 22.61,31.24 22.54,31.18 | C19.1 21.56,22.13 v21.84,21.84
  Top 0.813: CON1.+ 12.57,33.91 15.3,31.18 22.54,31.18 25.02,33.66 25.02,36.45 24.58,36.89 | C1.+ 11.3,49.91 v8.89,47.5
  other vias: 20.19,58.93 22.99,20.7 20.83,58.29 21.59,58.93
  pour Bottom (isolate 0.254): 20.1,61.24 6.33,47.38 6.42,34.12 22.68,17.96 23.13,17.93 25.15,19.94 25.15,20.32 21.6,24.27 14.48,31.39 14.48,37.75 10.05,40.76 10.1,46.51 22.12,58.69 22.13,59.89 20.81,61.24
  pour Top (no thermals): 18.92,58.93 20.7,60.71 21.21,60.71 22.67,59.25 20.64,57.21
  pour Top (no thermals): 24.38,20.83 22.86,19.3 19.46,22.7 21.11,24.35
!RESET  (via drill 0.35, 0.39)
  Top 0.254: v39.12,38.1 39.64,38.63 U1.40 | v32.26,23.88 32.26,15.37 31.88,14.99 C14.1 R10.2 | J14.1 J14.2 49.02,21.59 v46.74,23.88
  Bottom 0.254: v39.12,38.1 39.12,36.58 TP1.TP 37.34,35.56 32.26,30.48 v32.26,23.88 v46.74,23.88
ANALOG1  (via drill 0.35)
  Top 0.254: U1.3 46.58,42.7 47.5,41.78 v47.5,39.75 | v49.15,38.1 49.15,36.45 50.04,35.56 70.48,35.56 J13.3
  Bottom 0.254: v47.5,39.75 47.5,39.62 49.02,38.1 v49.15,38.1
ANALOG2
  Top 0.254: U1.7 46.99,44.7 49.02,42.67 49.02,39.24 50.16,38.1 70.48,38.1 J13.6
ANALOG3
  Top 0.254: U1.8 47.28,45.2 49.53,42.95 49.53,41.46 50.35,40.64 70.48,40.64 J13.9
ANALOG4
  Top 0.254: U1.9 47.65,45.7 50.16,43.18 70.48,43.18 J13.12
ANALOG5
  Top 0.254: U1.10 47.91,46.2 48.39,45.72 70.48,45.72 J13.15
ANALOG6
  Top 0.254: U1.11 48.1,46.7 49.66,48.26 70.48,48.26 J13.18
BST
  Top 0.305: C4.1 16.13,40.77 17.02,39.88 18.54,39.88 20.23,38.19 U2.5
D+
  Top 0.254: U1.34 35.46,42.7 34.54,41.78 34.54,13.08 40.64,6.98 USB1.3
D-
  Top 0.254: U1.33 35.2,43.2 34.04,42.04 34.04,12.7 39.99,6.75 USB1.2
ENC1A  (1 unrouted)
  Top 0.254: U1.24 38.14,52.15 32,58.29 32,60.96 28.19,64.77 24.38,64.77 22.19,66.97 J4.2
ENC1B
  Top 0.254: U1.23 38.64,52.41 32.51,58.55 32.51,61.28 26.03,67.77 J4.1
ENC2A
  Top 0.254: U1.29 34.41,45.2 32,42.8 32,30.86 30.73,29.59 20.32,29.59 13.81,23.08 13.81,21.44 J5.2
ENC2B
  Top 0.254: U1.30 34.67,44.7 32.51,42.55 32.51,30.5 30.99,28.97 21.76,28.97 J5.1
FB
  Top 0.305: 20.36,36.24 U2.8 18.2,36.24 R2.2 | 18.16,33.53 R3.1 R2.2 | R2.2 C5.1
GND  (via drill 0.35, 0.39)  (1 unrouted)
  Top 0.152: v44.32,49.78 46.86,52.32 v47.24,52.32
  Top 0.254: 40.77,42.2 40.8,42.2 42.3,43.7 U1.5 | 40.77,42.2 40.64,42.2 | 40.64,42.2 U1.35 | 40.64,42.2 40.64,40.95 U1.42 40.64,37.98 39.37,36.7 39.37,35.05 40.13,34.29 C10.1 | 40.77,42.2 41.14,42.58 U1.18 | J14.8 J14.7 | U7.7 40.54,27.08 v40.51,27.05
  Top 0.305: U9.9 37.33,59.94 C17.1 | v23.62,34.04 23.62,36.01 U2.1 | C3.1 v20.57,32.26
  other vias: 41.66,67.56 30.73,18.41 24.51,24.51 24.38,22.73 15.49,17.14 25.4,23.62 29.08,18.16 29.97,19.18 67.31,46.99 67.31,44.45 67.31,41.91 67.31,39.37 67.31,36.83 69.85,53.21 74.17,27.94 67.31,34.29 17.02,52.07 18.8,51.82 17.78,52.83 22.1,57.4 23.11,56.52 37.21,67.56 36.07,33.27 39.12,46.23 42.8,46.23 42.8,42.67 39.12,42.67 30.35,28.19 33.15,21.34 50.8,1.52 22.1,14.99 29.84,17.53 29.21,67.31 18.41,65.66 12.19,55.25 23.37,16.26 17.65,18.92 35.05,2.03 40.51,32.77 36.07,21.34 35.05,9.65 23.62,23.5 16.26,51.31 28.7,62.48 55.5,63.5 22.86,58.17 43.18,32.77 46.48,32.77 40.51,15.37 44.7,73.15 53.85,10.67 16.26,32.13 12.19,14.22 13.21,13.21 20.07,50.42 19.3,49.66 45.72,10.16 40.51,14.48 40.51,21.34 40.51,30.35 54.61,72.52 41.78,59.94 64.9,53.21 56.39,58.42 57.91,75.18 36.58,12.7 48.77,73.91 62.99,70.1 35.81,50.8 35.81,48.01 35.94,56.9 19.81,42.42 21.34,42.67 12.19,44.2 14.22,44.2 14.22,43.18 13.21,44.2
  pour Bottom (isolate 0.305, rank 2): 23.24,81.28 -0.13,57.4 0.02,22.99 23.5,0.02 58.04,-0.13 81.28,23.11 81.28,57.91 58.04,81.28
  pour Top (isolate 0.305, rank 2, no thermals): 23.37,81.28 0,57.4 -0.11,32.64 -0.05,23.35 23.75,0.27 58.42,0.12 81.41,23.11 81.41,57.91 58.17,81.28
  cutout Top: 25.78,48.01 25.78,45.85 26.92,45.85 26.92,48.01
  cutout Top: 40.64,32 41.27,32 41.27,32.64 41.4,32.64 43.31,30.73 43.31,29.72 43.18,29.59 42.93,29.59 40.64,31.88
  cutout Top: 43.69,11.94 43.87,11.94 43.87,11.05 43.69,11.05
  cutout Top: 41.66,6.1 41.66,9.4 41.15,9.4 41.15,6.1
  cutout Top: 38.61,60.45 40.77,60.45 40.77,58.93 38.61,58.93
MOTOR1A
  Top 0.254: U5.3 25.05,50.8 30.99,50.8 35.59,46.2 U1.27
MOTOR1B
  Top 0.254: U5.2 25.79,48.26 31.62,48.26 34.16,45.72 36.62,45.72 U1.28
MOTOR2A
  Top 0.254: U6.3 33.02,27.77 33.02,42.42 34.8,44.2 U1.31
MOTOR2B
  Top 0.254: U6.2 33.53,26.48 33.53,42.16 35.06,43.7 U1.32
N$1
  Top 0.254: U6.8 25.53,16.68 25.53,16.64
  Top 0.813: J3.2 22.46,13.57 25.53,16.64
N$2
  Top 0.254: U6.6 23.79,18.54 23.75,18.54
  Top 0.813: J3.1 20.5,15.3 23.75,18.54
N$4
  Top 0.254: U5.8 16.13,56.13
  Top 0.813: J2.2 13.07,59.19 16.13,56.13
N$5
  Top 0.254: J15.4 J15.3
N$6  (via drill 0.35)
  other vias: 2.79,50.55
N$7
  Top 0.254: U7.10 43.8,19.57 45.59,17.78 52.49,17.78 J10.1
N$8  (via drill 0.35)
  other vias: 6.22,20.45
N$9
  Top 0.254: J15.8 J15.7
N$10
  Top 0.254: U7.12 45.1,19.92 46.23,18.8 56.26,18.8 63.34,25.87 J8.1
N$11
  Top 0.254: SW1.1 SW1.4 29.72,8.89 R10.1
N$12
  Top 0.254: J15.10 J15.9
N$14
  Top 0.254: U1.43 41.14,37.59 40.51,36.96 C10.2
N$15
  Top 0.254: J15.12 J15.11
N$16
  Top 0.254: U5.6 18.07,57.78 18.03,57.78
  Top 0.813: J2.1 15.23,60.59 18.03,57.78
N$17
  Top 0.254: R4.1 D1.+
N$18
  Top 0.254: J15.16 J15.15
N$19
  Top 0.254: U5.4 24.64,54.63 R7.1
N$20
  Top 0.305: R8.1 27.73,24.34 U6.4
N$21
  Top 0.254: U7.11 44.45,19.69 45.85,18.29 60.2,18.29 60.54,18.29 J9.1
N$22
  Top 0.254: J15.14 J15.13
N$23  (via drill 0.35)
  Top 0.254: U2.6 19.36,37.54 v19.3,37.59 | v17.53,43.94 R1.1
  Bottom 0.254: v19.3,37.59 17.53,39.37 v17.53,43.94
N$29
  Top 0.305: U2.7 21.66,36.89 22.35,36.2 C3.2
N$42
  Top 0.254: J14.6 J14.5
N$45
  Top 0.254: J15.18 J15.17
N$46
  Top 0.254: J15.20 J15.19
N$48
  Top 0.254: J14.10 J14.9
N$49
  Top 0.254: J14.12 J14.11
N$50
  Top 0.254: J14.14 J14.13
N$51
  Top 0.254: J14.16 J14.15
N$52
  Top 0.254: J14.18 J14.17
N$53
  Top 0.254: J14.20 J14.19
N$54
  Top 0.254: J14.22 J14.21
N$55
  Top 0.254: J14.24 J14.23
N$56
  Top 0.254: J14.26 J14.25
N$57
  Top 0.254: J14.28 J14.27
N$58
  Top 0.254: J14.30 J14.29
N$59
  Top 0.254: J14.32 J14.31
NEOPIXEL
  Top 0.254: U1.15 42.64,51.15 49.91,58.42 54.36,58.42 54.73,58.42 U8.2
NEOPIXEL_INTERNAL
  Top 0.254: U8.4 59.22,63.85 64.3,68.94 64.3,70.97 D2.2
NEOPIXEL_OUT  (via drill 0.35)
  Top 0.254: v41.91,52.7 49.01,59.8 49.01,64.79 J11.1 54.47,70.28 57.54,73.35 D2.4
  Bottom 0.254: v41.91,52.7 33.53,52.7 32,51.18 32,33.53 31.5,33.02 29.21,33.02 J15.2
RX  (via drill 0.35)
  Top 0.254: U1.20 40.14,52.84 v47.24,59.94
  Bottom 0.254: J17.P$3 47.25,59.95 v47.24,59.94
SCL1
  Top 0.254: J15.22 J15.21 30.73,57.15 34.29,53.59 34.29,48.27 35.86,46.7 U1.26 | R13.2 32.77,68.68 J6.1
  Bottom 0.254: J15.21 31.81,58.48 31.81,69.64 J6.1
SCL2  (via drill 0.35, 0.39)
  Top 0.254: U1.22 39.14,54.77 39.62,55.25 v39.62,55.37 U9.13 | J16.P$2 38.11,74.93 42.55,70.5 42.55,65.41 | 42.55,65.41 v42.55,58.29 | R15.2 42.55,65.41
  Bottom 0.254: v42.55,58.29 v39.62,55.37
SDA1
  Top 0.254: J15.24 J15.23 30.48,58.93 36.64,52.76 U1.25 | R14.2 34.8,69.79 32.07,72.52 J6.2
  Bottom 0.254: J15.23 29.84,60.33 29.84,71.37 J6.2 30.95,72.54
SDA2
  Top 0.254: 41.91,55.5 45.09,58.67 45.09,65.41 | 41.91,55.5 39.64,53.23 U1.21 | J16.P$3 39.36,75.18 45.09,69.46 45.09,65.41 | R16.2 45.09,65.41 | U9.14 40.12,57.28 41.91,55.5
SERVO1  (via drill 0.35)
  Top 0.254: U1.1 45.14,40.96 45.47,40.64 v46.74,40.64
  Bottom 0.254: v46.74,40.64 59.56,40.64 67.81,48.88 J12.3
SERVO2  (via drill 0.35)
  Top 0.254: U1.2 46.19,42.2 v46.74,41.66
  Bottom 0.254: v46.74,41.66 47.24,41.66 48.77,43.18 59.82,43.18 66.01,49.37 J12.6
SERVO3
  Top 0.254: U1.13 43.64,50.1 46.89,53.34 57.66,53.34 64.21,59.89 J12.9
SERVO4
  Top 0.254: U1.14 43.14,50.67 48.35,55.88 55.88,55.88 61.78,61.78 61.78,63.29 J12.12
SONAR1ECHO
  Top 0.254: U7.5 43.8,28.21 38.87,33.14 38.87,36.91 40.14,38.19 U1.41
SONAR1TRIG
  Top 0.254: U1.39 39.14,39.14 38.35,38.35 38.35,18.54 39.62,17.27 51.18,17.27 55.88,12.57 J10.2
SONAR2ECHO
  Top 0.254: U7.4 44.45,37.85 43.14,39.15 U1.47
SONAR2TRIG
  Top 0.254: U1.38 38.64,39.28 37.85,38.48 37.85,18.16 39.24,16.76 50.67,16.76 56.26,11.18 57.71,11.18 63.27,16.74 63.55,17.02 J9.2
SONAR3ECHO
  Top 0.254: U7.3 45.1,38.48 45.1,38.74 U1.48
SONAR3TRIG
  Top 0.254: U1.37 37.34,39.39 37.34,17.91 38.99,16.26 50.29,16.26 58.93,7.62 61.09,7.62 69.22,15.75 69.58,16.11 J8.2
SW  (1 unrouted)
  Top 0.305: U2.3 22.41,37.54 22.23,37.72 22.23,40.39 22.53,40.7 22.53,40.91 | L1.1 18.4,40.91 C4.2
  pour Top (no thermals): 20.83,40.13 23.5,40.13 23.5,39.37 22.48,38.35 21.97,38.35 20.83,39.5
SWCLK  (via drill 0.39)
  Top 0.254: v36.07,32.26 36.07,31.75 R11.2 | U1.45 42.14,37.74 v42.29,37.59
  Bottom 0.254: v42.29,37.59 42.29,37.21 TP2.TP 37.34,32.26 v36.07,32.26
SWDIO  (via drill 0.39)
  Top 0.254: v43.31,37.59 43.31,37.96 42.64,38.62 U1.46
  Bottom 0.254: v43.31,37.59 43.31,35.69 TP3.TP
TX
  Top 0.254: U1.19 40.64,52.33 48.42,60.1 48.42,68.58 46,70.99 J17.P$2
VDDANA
  Top 0.254: 48.26,36.07 48.26,33.02 FB.1 | 48.26,36.07 48.26,41.91 45.97,44.2 U1.6 | C12.2 48.26,36.07
VSENSE  (via drill 0.35)
  Top 0.254: R5.1 25.5,63.48 R6.1 25.53,62.87 26.16,62.23 26.16,53.98 26.8,53.34 31.5,53.34 32.38,52.45 32.38,51.31 v33.53,50.16 | U1.12 45.14,48.58 v44.96,48.77
  Bottom 0.254: v33.53,50.16 34.92,48.77 v44.96,48.77

### Text on the board
tNames: I2C | COMPASS | GPS | GND | GND | VCC | 3.3V | 5V | SCL | SDA | GND | 5V | TX | RX | MOTOR1 | A | SDA | GND | DATA | B | SCL | 5V | NEOPIXEL | GND | 4 | 3 | 2 | SERVO | 1 | GND | 5V | SIGNAL | - | + | A6 | - | GND | A5 | A4 | A3 | ANALOG | A2 | A1 | + | POWER | 7-14V | GND | 3.3V | SIGNAL | B | VCC | A | GND | ECHO | TRIG | 5V | GND | SONAR3 | MOTOR2 | ECHO | TRIG | 5V | GND | SONAR2 | SONAR1 | RESET
bNames: RoverWing V1.2 / D. Bershadsky, A. Kirillov / roverwing.github.io